# Altium schematic sheet Main Power Switch.SchDoc: Main Power Switch
size A4; Date: Dec. 27th, 2022; Author: Karl Asseily; DrawnBy: Karl Asseily; DocumentNumber: 202301151913; Revision: 1.2; SheetNumber: 5; SheetTotal: 20
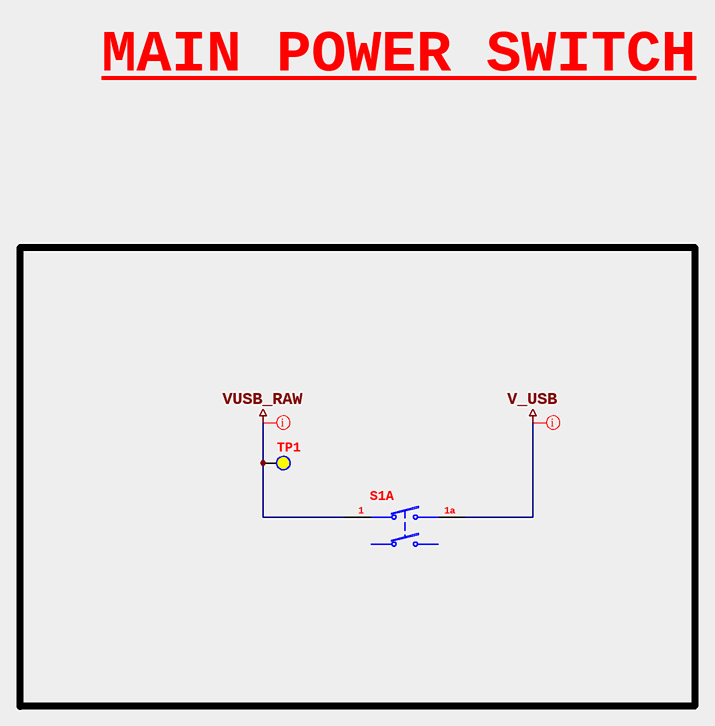
[diagram p0: Main Power Switch.SchDoc]

## Parts
S1  R1973BBLKBLKGR0  [SW_ROCKER-DPST_R1973BBLKBLKGR0]  (value not drawn)  (part A of 2)
TP1  VUSB_RAW  [TEST POINT HOLE]  (value not drawn)  (no BOM)

## Nets
V_USB: S1.1a
VUSB_RAW: S1.1 TP1.TP

## Layout directives
net class POWER; rule Supply Nets [Voltage = 5.000]: V_USB, VUSB_RAW

## Notes on the sheet
- MAIN POWER SWITCH
- Project
- Sheet
- Size
- Filename
- A4
- of
- Number
- Drawn By
- Rev.
- Variant
- Date

## Library data of the parts
S1 = SW4-ON-OFF-DPST_R1973BBLKBLKGR0_TH: Rocker Switch DPST 9A (AC) 125 V Panel Mount, Snap-In, Right Angle; Manufacturer: E-Switch; Mechanical Life: 30000Cycles; Voltage Rating (AC): 125V; Electrical Life: 10000Cycles; Switch Function: On-Off; Illumination Type: Illuminated; Supplier 1: Digi-Key; Manufacturer Part Number: R1973BBLKBLKGR0; RoHS: No; Category: Rocker Switches; Stock 1: 214; Pricing 1: 1=3.07000, 10=2.75300, 25=2.60040, 50=2.48640, 100=2.35950, 250=2.25804, 500=2.08044, 1000=1.97895 (USD); Mounting Technology: Panel,Snap in; Contact Plating: Silver; Min Operating Temperature: -30°C; Max Operating Temperature: 55°C; Package Quantity: 1; Current Rating: 9A; Packaging: Bulk; Termination: PC Pin; Throw Configuration: DPST; Series: R1973; Actuator Type: Rocker; RoHS Compliant: No; ComponentLink1URL: C:\Users\Public\Documents\Altium\Projects\Cellar_Watchdog\Docs\Switch\R1973.pdf; ComponentLink1Description: Datasheet; ComponentLink2Description: Drawing; ComponentLink2URL: C:\Users\Public\Documents\Altium\Projects\Cellar_Watchdog\Docs\Switch\M400001.pdf; Supplier Part Number 1: R1973BBLKBLKGR0-ND
TP1 = Test Point: PCB Test Point; Value: VUSB_RAW; ClassName: Test Point